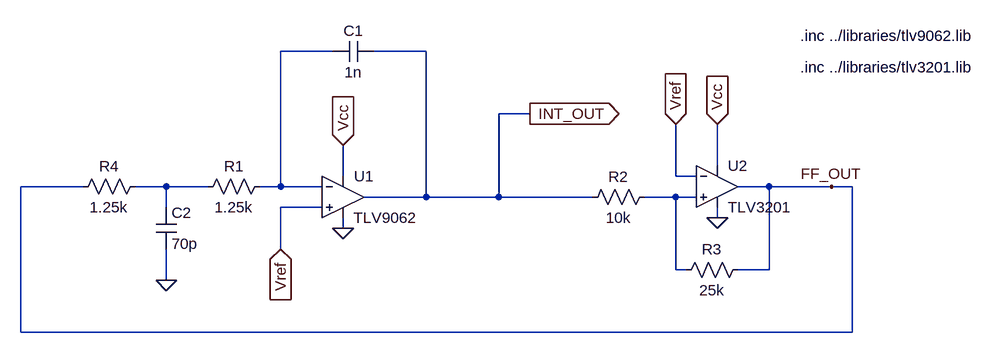
[diagram p0: schematic triangle_wave_gen_component.asc]
triangle_wave_gen_component.asc, the LTspice schematic file:
Version 4
SHEET 1 1432 836
WIRE -176 -16 -256 -16
WIRE -32 -16 -112 -16
WIRE 128 80 80 80
WIRE 416 160 416 96
WIRE -160 176 -160 128
WIRE 352 176 352 96
WIRE 384 176 352 176
WIRE -560 192 -656 192
WIRE -432 192 -480 192
WIRE -368 192 -432 192
WIRE -256 192 -256 -16
WIRE -256 192 -288 192
WIRE -192 192 -256 192
WIRE 496 192 448 192
WIRE 592 192 496 192
WIRE 624 192 592 192
WIRE -32 208 -32 -16
WIRE -32 208 -128 208
WIRE 80 208 80 80
WIRE 80 208 -32 208
WIRE 224 208 80 208
WIRE 352 208 304 208
WIRE 384 208 352 208
WIRE -432 224 -432 192
WIRE -192 224 -256 224
WIRE 416 240 416 224
WIRE -160 256 -160 240
WIRE -256 288 -256 224
WIRE 352 320 352 208
WIRE 368 320 352 320
WIRE 496 320 496 192
WIRE 496 320 448 320
WIRE -432 336 -432 288
WIRE -656 416 -656 192
WIRE 624 416 624 192
WIRE 624 416 -656 416
FLAG -160 256 0
FLAG 416 240 0
FLAG -256 288 Vref
IOPIN -256 288 In
FLAG 352 96 Vref
IOPIN 352 96 In
FLAG 416 96 Vcc
IOPIN 416 96 In
FLAG -160 128 Vcc
IOPIN -160 128 In
FLAG 592 192 FF_OUT
FLAG 128 80 INT_OUT
IOPIN 128 80 Out
FLAG -432 336 0
SYMBOL OpAmps\\opamp2 -160 144 R0
WINDOW 0 32 32 Center 2
SYMATTR InstName U1
SYMATTR Value TLV9062
SYMBOL OpAmps\\opamp2 416 128 R0
SYMATTR InstName U2
SYMATTR Value TLV3201
SYMBOL cap -112 -32 R90
WINDOW 0 0 32 VBottom 2
WINDOW 3 32 32 VTop 2
SYMATTR InstName C1
SYMATTR Value 1n
SYMBOL res -272 176 R90
WINDOW 0 0 56 VBottom 2
WINDOW 3 32 56 VTop 2
SYMATTR InstName R1
SYMATTR Value 1.25k
SYMBOL res 320 192 R90
WINDOW 0 0 56 VBottom 2
WINDOW 3 32 56 VTop 2
SYMATTR InstName R2
SYMATTR Value 10k
SYMBOL res 464 304 R90
WINDOW 0 0 56 VBottom 2
WINDOW 3 32 56 VTop 2
SYMATTR InstName R3
SYMATTR Value 25k
SYMBOL res -464 176 R90
WINDOW 0 0 56 VBottom 2
WINDOW 3 32 56 VTop 2
SYMATTR InstName R4
SYMATTR Value 1.25k
SYMBOL cap -448 224 R0
SYMATTR InstName C2
SYMATTR Value 70p
TEXT 544 -40 Left 2 !.inc ../libraries/tlv9062.lib
TEXT 544 8 Left 2 !.inc ../libraries/tlv3201.lib

The netlist it stands for:
* triangle_wave_gen_component.asc
XU1 Vref N001 Vcc 0 INT_OUT TLV9062  ; pins In+ In- V+ V- OUT
XU2 N003 Vref Vcc 0 FF_OUT TLV3201  ; pins In+ In- V+ V- OUT
C1 INT_OUT N001 1n
R1 N001 N002 1.25k
R2 N003 INT_OUT 10k
R3 FF_OUT N003 25k
R4 N002 FF_OUT 1.25k
C2 N002 0 70p
.inc ../libraries/tlv9062.lib
.inc ../libraries/tlv3201.lib
.backanno
.end